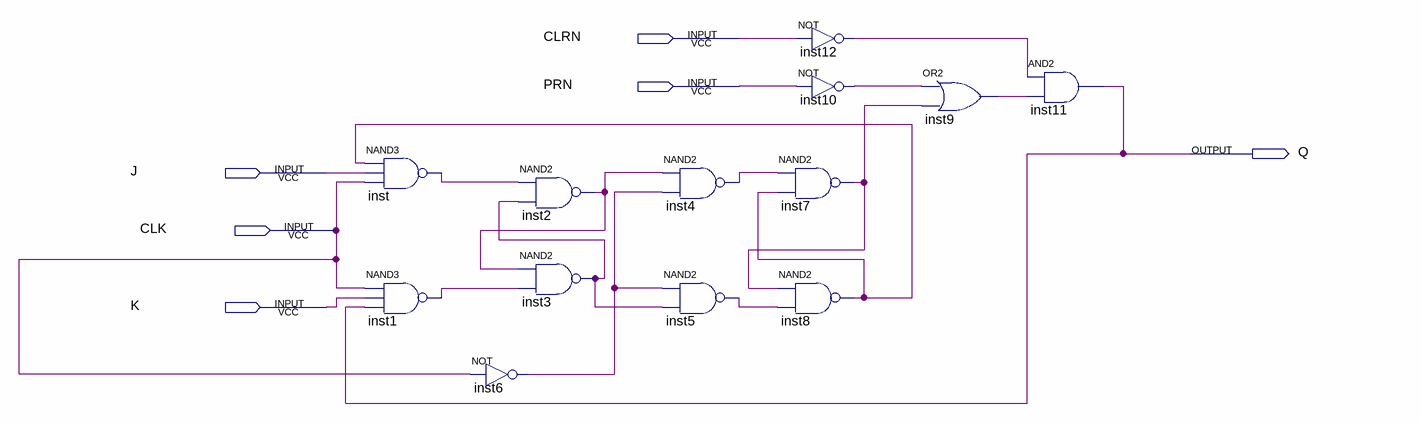
[diagram p0: schematic sheet]
// Quartus schematic JK_reset_ff.bdf as structural Verilog: 13 symbols, 6 pins
module JK_reset_ff (
  input  CLRN,
  input  PRN,
  input  J,
  input  CLK,
  input  K,
  output Q
);

  wire inst1_out, inst2_out, inst3_out, inst4_out, inst5_out, inst6_out, inst7_out, inst8_out, inst9_out,
       inst10_out, inst12_out, inst_out;

  nand inst (inst_out, inst8_out, J, CLK);
  nand inst1 (inst1_out, CLK, K, Q);
  not inst6 (inst6_out, CLK);
  nand inst2 (inst2_out, inst_out, inst3_out);
  nand inst3 (inst3_out, inst2_out, inst1_out);
  nand inst4 (inst4_out, inst2_out, inst6_out);
  nand inst5 (inst5_out, inst6_out, inst3_out);
  nand inst7 (inst7_out, inst4_out, inst8_out);
  nand inst8 (inst8_out, inst7_out, inst5_out);
  not inst12 (inst12_out, CLRN);
  not inst10 (inst10_out, PRN);
  or inst9 (inst9_out, inst10_out, inst7_out);
  and inst11 (Q, inst12_out, inst9_out);
endmodule
